# EAGLE design 12VDCDC (EAGLE 7.2.0)
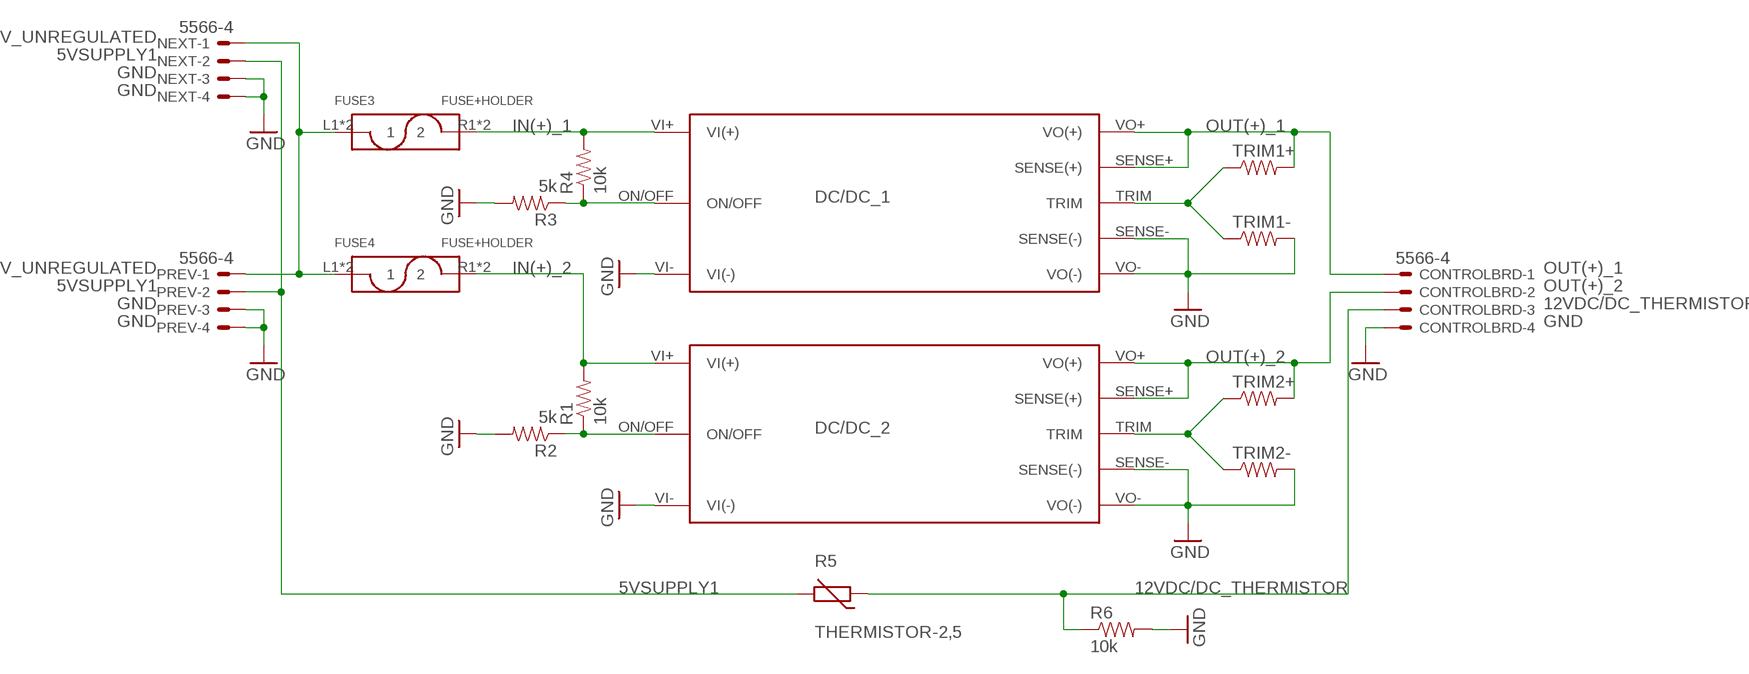
[diagram p0: schematic, sheet 1]

## Parts
CONTROLBRD  5566-4  [5566-4]
DC/DC_1  DC/DC-EIGHTH_BRICKEHHD006A0B41-HZ  [DC/DC-EIGHTH_BRICK]
DC/DC_2  DC/DC-EIGHTH_BRICKEHHD006A0B41-HZ  [DC/DC-EIGHTH_BRICK]
FUSE3  FUSE+HOLDER  [FUSE-HOLDER]
FUSE4  FUSE+HOLDER  [FUSE-HOLDER]
NEXT  5566-4  [5566-4]
PREV  5566-4  [5566-4]
R1  10k  RESISTORAXIAL-0.3  [AXIAL-0.3]
R2  5k  RESISTORAXIAL-0.3  [AXIAL-0.3]
R3  5k  RESISTORAXIAL-0.3  [AXIAL-0.3]
R4  10k  RESISTORAXIAL-0.3  [AXIAL-0.3]
R5  THERMISTOR-2,5  [RS-2,5]
R6  10k  RESISTORAXIAL-0.3  [AXIAL-0.3]
TRIM1+  RESISTORPTH-1/4W  [AXIAL-0.4]
TRIM1-  RESISTORPTH-1/4W  [AXIAL-0.4]
TRIM2+  RESISTORPTH-1/4W  [AXIAL-0.4]
TRIM2-  RESISTORPTH-1/4W  [AXIAL-0.4]

## Nets
5VSUPPLY1: NEXT.2 PREV.2 R5.2
12VDC/DC_THERMISTOR: CONTROLBRD.3 R5.1 R6.P$1
GND: CONTROLBRD.4 DC/DC_1.SENSE-(SENSE(-)) DC/DC_1.VI-(VI(-)) DC/DC_1.VO-(VO(-)) DC/DC_2.SENSE-(SENSE(-)) DC/DC_2.VI-(VI(-)) DC/DC_2.VO-(VO(-)) NEXT.3 NEXT.4 PREV.3 PREV.4 R2.P$2 R3.P$2 R6.P$2 TRIM1-.P$2 TRIM2-.P$2
IN(+)_1: DC/DC_1.VI+(VI(+)) FUSE3.R1 FUSE3.R2 R4.P$2
IN(+)_2: DC/DC_2.VI+(VI(+)) FUSE4.R1 FUSE4.R2 R1.P$2
LV_UNREGULATED: FUSE3.L1 FUSE3.L2 FUSE4.L1 FUSE4.L2 NEXT.1 PREV.1
N$1: DC/DC_1.TRIM TRIM1+.P$1 TRIM1-.P$1
N$2: DC/DC_2.ON/OFF R1.P$1 R2.P$1
N$3: DC/DC_1.ON/OFF R3.P$1 R4.P$1
N$5: DC/DC_2.TRIM TRIM2+.P$1 TRIM2-.P$1
OUT(+)_1: CONTROLBRD.1 DC/DC_1.SENSE+(SENSE(+)) DC/DC_1.VO+(VO(+)) TRIM1+.P$2
OUT(+)_2: CONTROLBRD.2 DC/DC_2.SENSE+(SENSE(+)) DC/DC_2.VO+(VO(+)) TRIM2+.P$2

## Library data of the parts
CONTROLBRD NEXT PREV = con-molex:5566-4: Mini FIT connector 4 pol Source: http://www.molex.com; OC_FARNELL: unknown; OC_NEWARK: unknown
DC/DC_1 DC/DC_2 = HyTech 2016:DC/DC-EIGHTH_BRICK: Eighth Brick DC/DC
FUSE3 FUSE4 = HyTech 2016:FUSE+HOLDER
R1-R4 R6 TRIM1+ TRIM1- TRIM2+ TRIM2- = HyTech 2016:RESISTOR: Resistor Basic schematic elements and footprints for 0603, 1206, and PTH resistors.
R5 = varistor:THERMISTOR: THERMISTOR

## Board
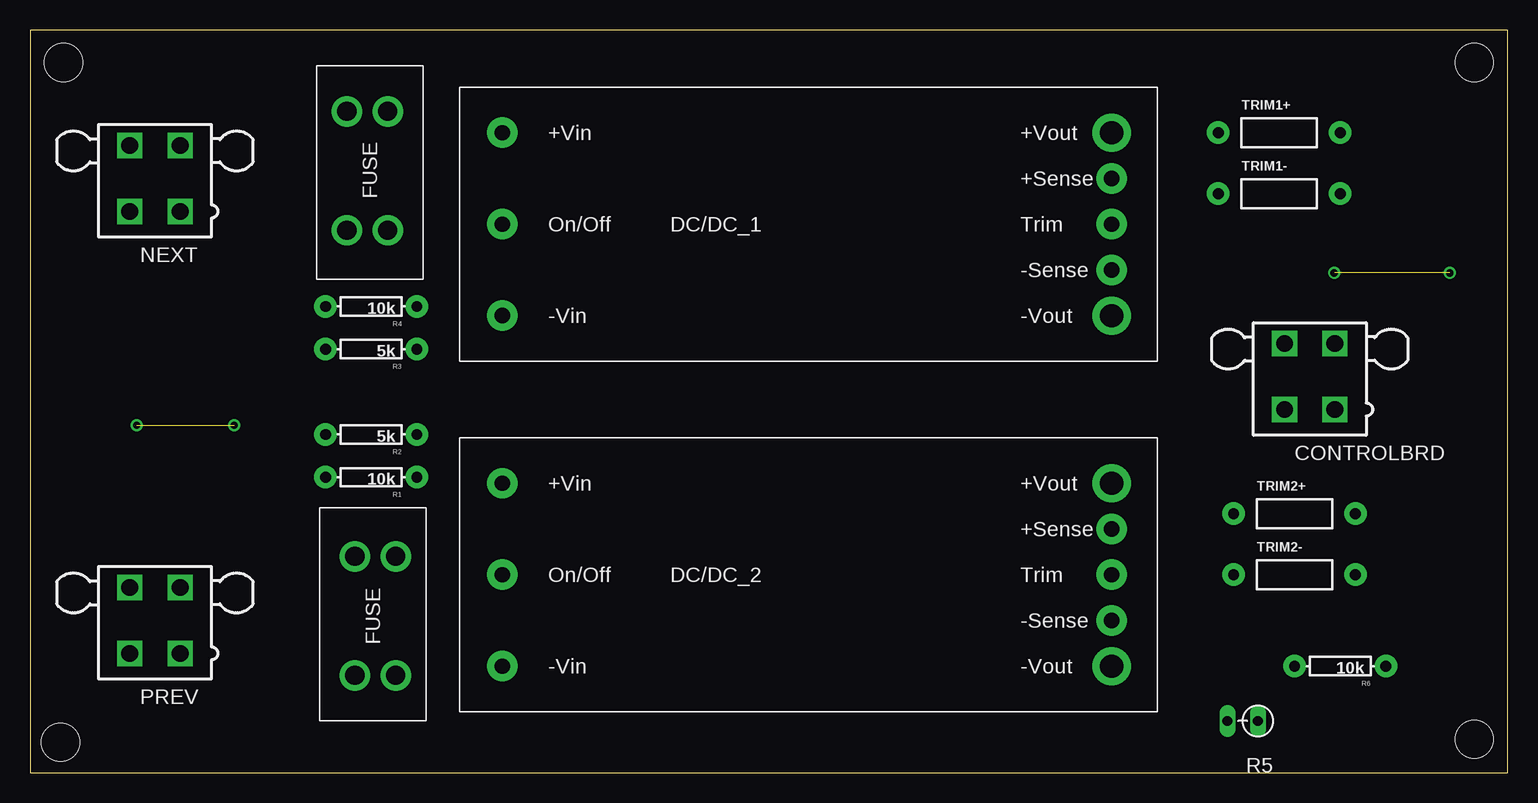
[diagram p1: board, top side]
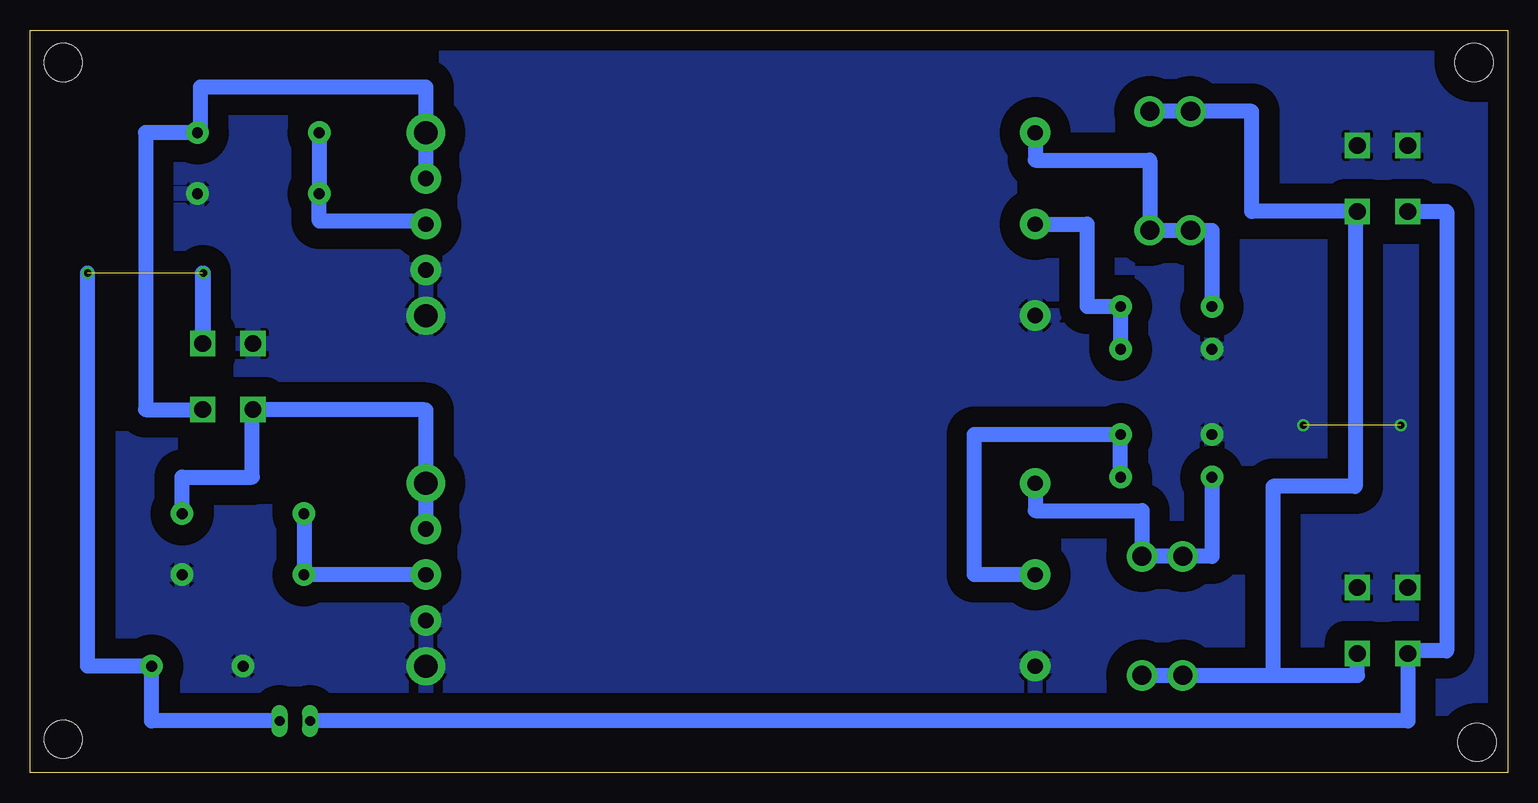
[diagram p2: board, bottom side, seen from below]

Size 123.17 x 61.9 mm. Coordinates in mm from the lower left corner, seen from the top.
Outline: 0,0 123.17,0 123.17,61.9 0,61.9 0,0
Copper layers (1*16): Top 0.035mm / dielectric 1.5mm / Bottom 0.035mm
Design rules "default": minimum track width 10mil, minimum drill 24mil, track to track 8mil, track to pad 8mil, pad to pad 8mil, via to via 8mil, smd to smd 8mil, copper to edge 40mil, drill to drill 8mil, minimum pad ring 10mil, minimum via ring 8mil, stop-mask expansion 4mil, vias tented up to drill 0mil, thermal gap 10mil
Holes 3.17 mm at 2.79,59.18 2.54,2.54 120.4,2.79 120.4,59.18

### Footprints (pad centres in the part's own frame; a part is rotated, then mirrored left to right if it is on the bottom)
5566-4 = drill 1.4 square: 1 2.1,-2.75; 2 -2.1,-2.75; 3 2.1,2.75; 4 -2.1,2.75
DC/DC-EIGHTH_BRICK = drill 1.27 pad 2.54: ON/OFF 0,-7.62; SENSE+ 50.8,-3.81; SENSE- 50.8,-11.43; TRIM 50.8,-7.62; VI+ 0,0; VI- 0,-15.24 | drill 1.93 pad 3.175: VO+ 50.8,0; VO- 50.8,-15.24
FUSE-HOLDER = drill 1.6 pad 2.54: L1 0,3.404; L2 0,0; R1 9.906,3.404; R2 9.906,0
AXIAL-0.3 = drill 0.9 pad 1.88: P$1 -3.81,0; P$2 3.81,0
RS-2,5 = drill 0.813 long: 1 -1.27,0; 2 1.27,0
AXIAL-0.4 = drill 0.9 pad 1.88: P$1 -5.08,0; P$2 5.08,0

### Placement (x,y rotation side)
CONTROLBRD  106.68,33.02 0 top
DC/DC_1  39.37,53.34 0 top
DC/DC_2  39.37,24.13 0 top
FUSE3  26.42,55.12 270 top
FUSE4  30.48,8.13 90 top
NEXT  10.41,49.53 0 top
PREV  10.41,12.7 0 top
R1  28.45,24.64 180 top
R2  28.45,28.19 180 top
R3  28.45,35.31 180 top
R4  28.45,38.86 180 top
R5  101.09,4.32 180 top
R6  109.22,8.89 180 top
TRIM1+  104.14,53.34 0 top
TRIM1-  104.14,48.26 0 top
TRIM2+  105.41,21.59 0 top
TRIM2-  105.41,16.51 0 top

### Tracks (layer width: path | path; a pad name or v marks a point on that pad's centre or on a via)
5VSUPPLY1
  Bottom 1.27: NEXT.2 5.08,46.78 5.08,10.16 8.31,10.16 PREV.2 8.31,4.32 R5.2
12VDC/DC_THERMISTOR  (1 unrouted)
  Bottom 1.27: R5.1 113.03,4.32 R6.P$1 118.36,8.89 118.36,41.66 | CONTROLBRD.3 108.78,41.66 108.71,41.66 108.71,35.81
GND  (via drill 0.6)  (1 unrouted)
  other vias: 17.02,28.96 8.89,28.96
  pour Bottom (isolate 1.676): 124.46,62.74 124.46,-1.02 -0.51,-1.02 -0.51,62.99
IN(+)_1
  Bottom 1.27: DC/DC_1.VI+ 39.37,51.05 29.82,51.05 FUSE3.R1 FUSE3.R2 24.64,45.21 R4.P$2
IN(+)_2
  Bottom 1.27: R1.P$2 24.64,18.03 FUSE4.R1 FUSE4.R2 30.48,21.84 39.37,21.84 DC/DC_2.VI+
LV_UNREGULATED
  Bottom 1.27: NEXT.1 12.7,46.78 | 19.56,8.13 12.51,8.13 PREV.1 | 12.7,46.78 12.7,23.88 19.56,23.88 19.56,8.13 | 12.7,46.78 21.34,46.78 21.34,55.12 FUSE3.L2 FUSE3.L1 | FUSE4.L2 FUSE4.L1 19.56,8.13
N$1
  Bottom 1.27: TRIM1+.P$1 TRIM1-.P$1 99.06,45.97 90.17,45.97 DC/DC_1.TRIM
N$2
  Bottom 1.27: R1.P$1 R2.P$1 44.45,28.19 44.45,16.51 DC/DC_2.ON/OFF
N$3
  Bottom 1.27: DC/DC_1.ON/OFF 35.05,45.72 35.05,38.86 R4.P$1 R3.P$1
N$4  (via drill 0.6)
  other vias: 118.36,41.66
N$5
  Bottom 1.27: TRIM2+.P$1 TRIM2-.P$1 DC/DC_2.TRIM
N$6  (via drill 0.6)
  other vias: 108.71,41.66
OUT(+)_1
  Bottom 1.27: DC/DC_1.SENSE+ DC/DC_1.VO+ 90.17,57.15 108.97,57.15 108.97,53.34 TRIM1+.P$2 113.54,53.34 113.54,30.27 CONTROLBRD.1
OUT(+)_2
  Bottom 1.27: DC/DC_2.SENSE+ DC/DC_2.VO+ 90.17,30.23 90.42,30.23 90.42,30.27 CONTROLBRD.2 104.65,30.27 104.65,24.64 110.49,24.64 TRIM2+.P$2